# EAGLE design untitled (EAGLE 9.2.2)
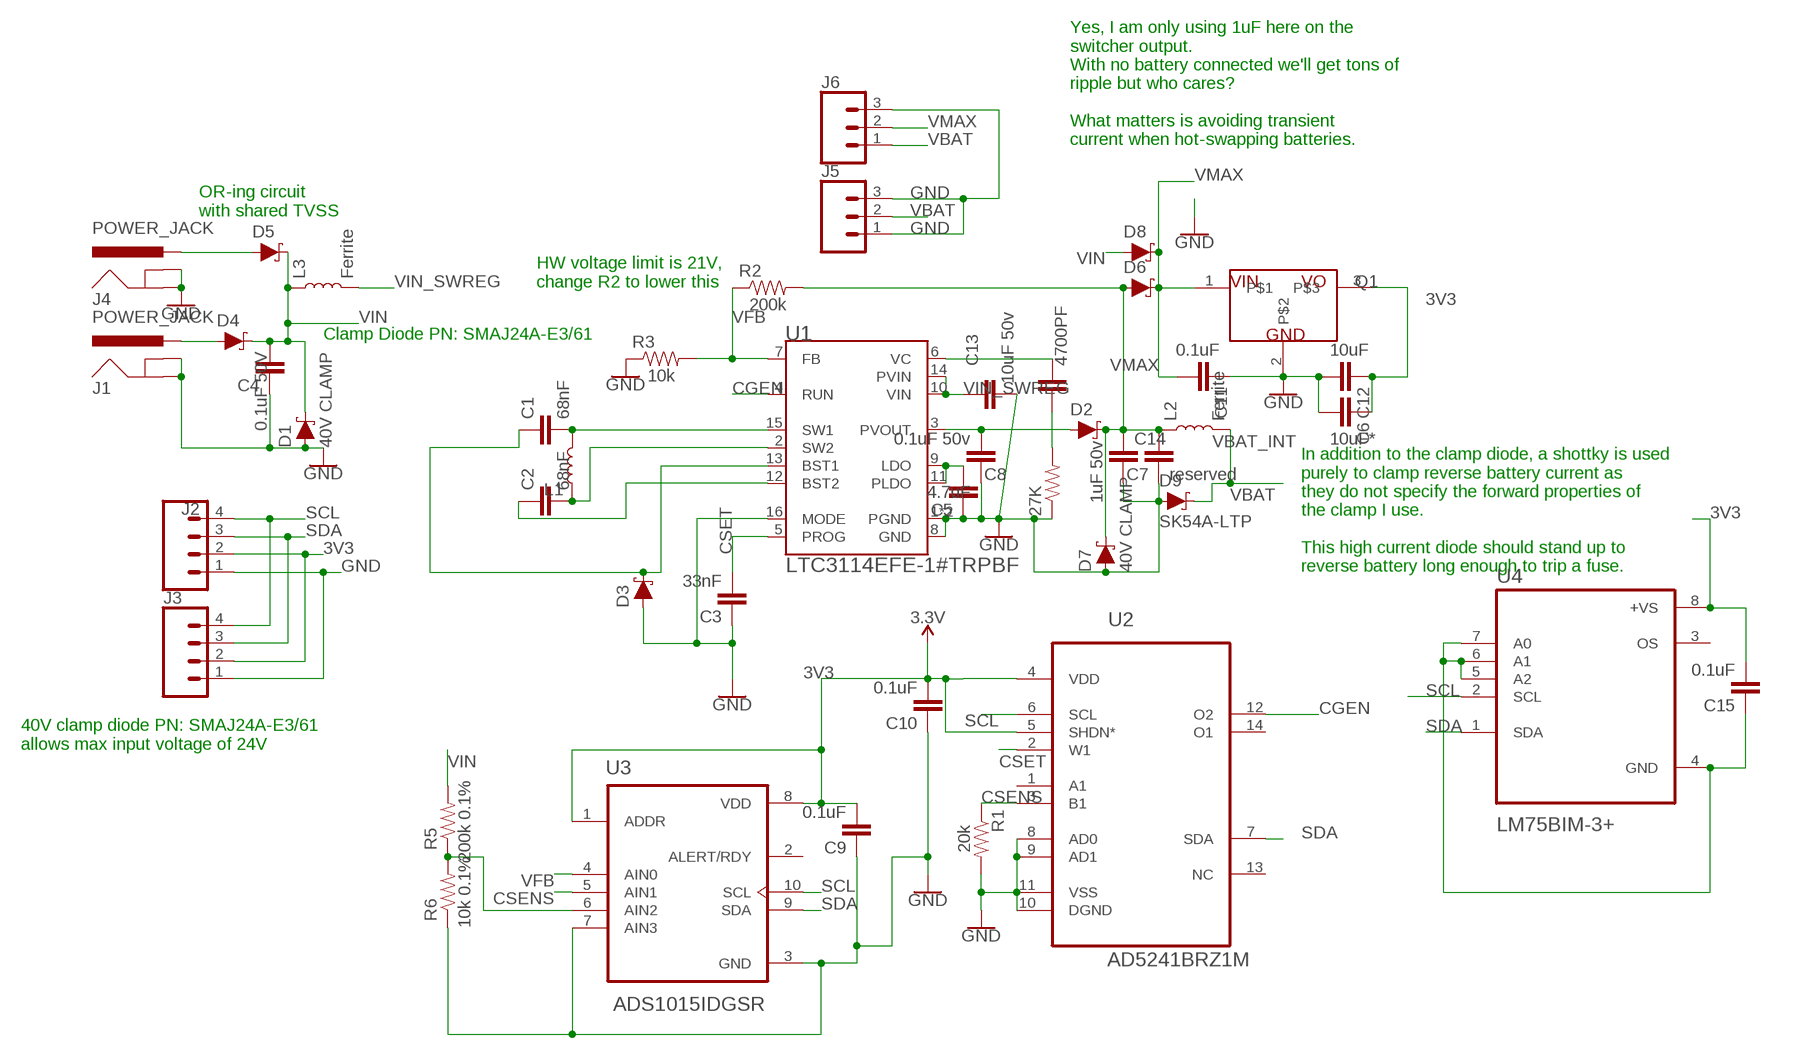
[diagram p0: schematic, sheet 1]

## Parts
27K  RESISTOR0805  [0805-EZ]
4700PF  1.0uF  1.0UF-0805-25V-10%  [0805-EZ]
C1  68nF  1.0UF-0805-25V-10%  [0805-EZ]
C2  68nF  1.0UF-0805-25V-10%  [0805-EZ]
C3  33nF  1.0UF-0805-25V-10%  [0805-EZ]
C4  0.1uF 50V  1.0UF-0805-25V-10%  [0805-EZ]
C5  4.7uF  1.0UF-0805-25V-10%  [0805-EZ]
C6  10uF*  1.0UF-0805-25V-10%  [0805-EZ]
C7  reserved  1.0UF-1206-50V-10%  [1206]
C8  0.1uF 50v  1.0UF-0805-25V-10%  [0805-EZ]
C9  0.1uF  1.0UF-0805-25V-10%  [0805-EZ]
C10  0.1uF  1.0UF-0805-25V-10%  [0805-EZ]
C11  0.1uF  1.0UF-0805-25V-10%  [0805-EZ]
C12  10uF  1.0UF-0805-25V-10%  [0805-EZ]
C13  10uF 50v  1.0UF-1206-50V-10%  [1206]
C14  1uF 50v  1.0UF-0805-25V-10%  [0805-EZ]
C15  0.1uF  1.0UF-0805-25V-10%  [0805-EZ]
D1  40V CLAMP  DIODE-SCHOTTKY-B340A  [SMA-DIODE]
D2  3A/40V/500mV  DIODE-SCHOTTKY-B340A  [SMA-DIODE]
D3  3A/40V/500mV  DIODE-SCHOTTKY-B340A  [SMA-DIODE]
D4  3A/40V/500mV  DIODE-SCHOTTKY-B340A  [SMA-DIODE]
D5  3A/40V/500mV  DIODE-SCHOTTKY-B340A  [SMA-DIODE]
D6  3A/40V/500mV  DIODE-SCHOTTKY-B340A  [SMA-DIODE]
D7  40V CLAMP  DIODE-SCHOTTKY-B340A  [SMA-DIODE]
D8  3A/40V/500mV  DIODE-SCHOTTKY-B340A  [SMA-DIODE]
D9  SK54A-LTP  DIODE-SCHOTTKY-B340A  [SMA-DIODE]
J1  POWER_JACK  [POWER_JACK_PTH]
J2  CONN_04JST-PTH-VERT  [JST-4-PTH-VERT]
J3  CONN_04JST-PTH-VERT  [JST-4-PTH-VERT]
J4  POWER_JACK  [POWER_JACK_PTH]
J5  CONN_03SCREW_LOCK  [SCREWTERMINAL-3.5MM-3_LOCK.007S]
J6  CONN_03SCREW_LOCK  [SCREWTERMINAL-3.5MM-3_LOCK.007S]
L1  27µH/±20%/3.3A  INDUCTOR-SDR13-27UH  [INDUCTOR_SDR1307]
L2  Ferrite  INDUCTOR-0805-3.3UH  [0805]
L3  Ferrite  INDUCTOR-0805-3.3UH  [0805]
Q1  BD433M5FP-CE2TO252_STM  [TO252_STM]
R1  20k  RESISTOR0805  [0805-EZ]
R2  200k  RESISTOR0805  [0805-EZ]
R3  10k  RESISTOR0805  [0805-EZ]
R5  200k 0.1%  RESISTOR0805  [0805-EZ]
R6  10k 0.1%  RESISTOR0805  [0805-EZ]
U1  LTC3114EFE-1#TRPBF  [SOP65P640X110-17N]
U2  AD5241BRZ1M  [SOIC127P600X175-14N]
U3  ADS1015IDGSR  [SOP50P490X110-10N]
U4  LM75BIM-3+  [SOIC127P600X175-8N]

## Nets
3V3: C6.1 C9.2 C10.2 C12.1 C15.2 J2.2 J3.2 Q1.3 U2.4(VDD) U2.5(SHDN*) U3.1(ADDR) U3.8(VDD) U4.8(+VS) ; supply symbol labelled 3.3V
CGEN: U1.4(RUN) U2.12(O2)
CSENS: R1.1 U2.3(B1) U3.5(AIN1)
CSET: C3.2 U1.5(PROG) U2.2(W1)
GND: 27K.1 C3.1 C4.1 C5.1 C6.2 C7.1 C8.1 C9.1 C10.1 C11.1 C12.2 C13.2 C14.2 D1.A D3.A D7.A D9.A J1.GND J1.GNDBREAK J2.1 J3.1 J4.GND J4.GNDBREAK J5.1 J5.3 J6.3 Q1.2 R1.2 R3.1 R6.1 U1.1(PGND) U1.8(GND) U1.16(MODE) U1.17(PGND) U2.8(AD0) U2.9(AD1) U2.10(DGND) U2.11(VSS) U3.3(GND) U3.7(AIN3)
N$1: C1.2 L1.P$2 U1.15(SW1)
N$2: C2.2 L1.P$1 U1.2(SW2)
N$3: C1.1 D3.C U1.13(BST1)
N$4: C2.1 U1.12(BST2)
N$5: D4.A J1.PWR
N$6: R5.1 R6.2 U3.6(AIN2)
N$7: C15.1 U4.4(GND) U4.5(A2) U4.6(A1) U4.7(A0)
N$8: D5.A J4.PWR
N$9: C8.2 D2.A U1.3(PVOUT)
N$13: C5.2 U1.9(LDO) U1.11(PLDO)
N$14: 4700PF.2 U1.6(VC)
N$15: 27K.2 4700PF.1
SCL: J2.4 J3.4 U2.6(SCL) U3.10(SCL) U4.2(SCL)
SDA: J2.3 J3.3 U2.7(SDA) U3.9(SDA) U4.1(SDA)
VBAT: D9.C J5.2 J6.1 L2.2
VBAT_INT: C7.2 C14.1 D2.C D6.A D7.C L2.1 R2.2
VFB: R2.1 R3.2 U1.7(FB) U3.4(AIN0)
VIN: C4.2 D1.C D4.C D5.C D8.A L3.1 R5.2
VIN_SWREG: C13.1 L3.2 U1.10(VIN) U1.14(PVIN)
VMAX: C11.2 D6.C D8.C J6.2 Q1.1
Unconnected: U2.1(A1) U2.13(NC) U2.14(O1) U3.2(ALERT/RDY) U4.3(OS)

## Notes on the sheet
- Yes, I am only using 1uF here on the 
  switcher output. 
  With no battery connected we'll get tons of
  ripple but who cares?
  
  What matters is avoiding transient
  current when hot-swapping batteries.
- OR-ing circuit
  with shared TVSS
- HW voltage limit is 21V,
  change R2 to lower this
- Clamp Diode PN: SMAJ24A-E3/61
- In addition to the clamp diode, a shottky is used
  purely to clamp reverse battery current as
  they do not specify the forward properties of
  the clamp I use.
  
  This high current diode should stand up to
  reverse battery long enough to trip a fuse.
- 40V clamp diode PN: SMAJ24A-E3/61
  allows max input voltage of 24V

## Library data of the parts
27K R1-R3 R5 R6 = smd_passives_easy:RESISTOR: Generic Resistor Package
4700PF = smd_passives_easy:1.0UF: 1µF ceramic capacitors A capacitor is a passive two-terminal electrical component used to store electrical energy temporarily in an electric field.; PROD_ID: CAP-08064
C1-C6 C8-C12 C14 C15 = smd_passives_easy:1.0UF: 1µF ceramic capacitors A capacitor is a passive two-terminal electrical component used to store electrical energy temporarily in an electric field.; PROD_ID: CAP-08064; VALUE: 1.0uF
C7 C13 = SparkFun-Capacitors:1.0UF: 1µF ceramic capacitors A capacitor is a passive two-terminal electrical component used to store electrical energy temporarily in an electric field.; PROD_ID: CAP-09822; VALUE: 1.0uF
D1 D7 D9 = SparkFun-DiscreteSemi:DIODE-SCHOTTKY: Schottky diode A Schottky diode is a semiconductor diode which has a low forward voltage drop and a very fast switching action.; PROD_ID: DIO-09886; VALUE: 3A/40V/500mV
D2-D6 D8 = SparkFun-DiscreteSemi:DIODE-SCHOTTKY: Schottky diode A Schottky diode is a semiconductor diode which has a low forward voltage drop and a very fast switching action.; PROD_ID: DIO-09886
J1 J4 = SparkFun-Connectors:POWER_JACK: Power Jack Connector This is the standard 5.5mm barrel jack for power. The PTH is the most common, proven, reliable, footprint. The Slot footprint only works if the mill layer is transmitted to the PCB fab house so be warned. Here are the connectors we sell at SparkFun: DC Barrel Power Jack/Connector <https://www.sparkfun.com/products/119> (PRT-00119) DC Barrel Power Jack/Connector (SMD) <https://www.sparkfun.com/products/12748> (PRT-12748) DC Barrel Jack Adapter - Breadboard Compatible <https://www.sparkfun.com/products/10811> (PRT-10811) It is used on this SparkFun product (and many, many others): SparkFun RedBoard - Programmed with Arduino <https://www.sparkfun.com/products/12757> (DEV-12757) Also, if you need a mating power supply or connector, please check these out: Wall Adapter Power Supply - 9VDC 650mA <https://www.sparkfun.com/products/298> (TOL-00298) DC Barrel Jack Adapter - Male <https://www.sparkfun.com/products/10287> (PRT-10287); PROD_ID: CONN-08197
J2 J3 = SparkFun-Connectors:CONN_04: Multi connection point. Often used as Generic Header-pin footprint for 0.1 inch spaced/style header connections On any of the 0.1 inch spaced packages, you can populate with these: Break Away Headers - Straight <https://www.sparkfun.com/products/116> (PRT-00116) Break Away Male Headers - Right Angle <https://www.sparkfun.com/products/553> (PRT-00553) Female Headers <https://www.sparkfun.com/products/115> (PRT-00115) Break Away Headers - Machine Pin <https://www.sparkfun.com/products/117> (PRT-00117) Break Away Female Headers - Swiss Machine Pin <https://www.sparkfun.com/products/743> (PRT-00743) For SCREWTERMINALS and SPRING TERMINALS visit here: Screw Terimnals on SparkFun.com <https://www.sparkfun.com/search/results?term=Screw+Terminals> (5mm/3.5mm/2.54mm spacing) This device is also useful as a general connection point to wire up your design to another part of your project. Our various solder wires solder well into these plated through hole pads. Hook-Up Wire - Assortment (Stranded, 22 AWG) <https://www.sparkfun.com/products/11375> (PRT-11375) Hook-Up Wire - Assortment (Solid Core, 22 AWG) <https://www.sparkfun.com/products/11367> (PRT-11367) View the entire wire category on our website here <https://www.sparkfun.com/categories/141> Special notes: Molex polarized connector foot print use with SKU : PRT-08231 with associated crimp pins and housings. 1MM SMD Version SKU: PRT-10208; PROD_ID: CONN-13251
J5 J6 = SparkFun-Connectors:CONN_03: Multi connection point. Often used as Generic Header-pin footprint for 0.1 inch spaced/style header connections On any of the 0.1 inch spaced packages, you can populate with these: Break Away Headers - Straight <https://www.sparkfun.com/products/116> (PRT-00116) Break Away Male Headers - Right Angle <https://www.sparkfun.com/products/553> (PRT-00553) Female Headers <https://www.sparkfun.com/products/115> (PRT-00115) Break Away Headers - Machine Pin <https://www.sparkfun.com/products/117> (PRT-00117) Break Away Female Headers - Swiss Machine Pin <https://www.sparkfun.com/products/743> (PRT-00743) Stackable Header - 3 Pin (Female, 0.1") <https://www.sparkfun.com/products/13875> (PRT-13875) For SCREWTERMINALS and SPRING TERMINALS visit here: Screw Terimnals on SparkFun.com <https://www.sparkfun.com/search/results?term=Screw+Terminals> (5mm/3.5mm/2.54mm spacing) This device is also useful as a general connection point to wire up your design to another part of your project. Our various solder wires solder well into these plated through hole pads. Hook-Up Wire - Assortment (Stranded, 22 AWG) <https://www.sparkfun.com/products/11375> (PRT-11375) Hook-Up Wire - Assortment (Solid Core, 22 AWG) <https://www.sparkfun.com/products/11367> (PRT-11367) View the entire wire category on our website here <https://www.sparkfun.com/categories/141> Special notes: Molex polarized connector foot print use with SKU : PRT-08232 with associated crimp pins and housings.; PROD_ID: CONN-08288; SF_ID: PRT-08235
L1 = SparkFun-Coils:INDUCTOR: Inductors Resist changes in electrical current. Basically a coil of wire. SparkFun Products: SparkFun Load Cell Amplifier - HX711 <https://www.sparkfun.com/products/13879> IOIO-OTG - V2.2 <https://www.sparkfun.com/products/13613>; PROD_ID: NDUC-12529
L2 L3 = SparkFun-Coils:INDUCTOR: Inductors Resist changes in electrical current. Basically a coil of wire. SparkFun Products: SparkFun Load Cell Amplifier - HX711 <https://www.sparkfun.com/products/13879> IOIO-OTG - V2.2 <https://www.sparkfun.com/products/13613>; PROD_ID: NDUC-13076; VALUE: 3.3µH/±20%/450mA
Q1 = danny:BD433M5FP-CE2: IGBT
U1 = LTC3114EFE-1_TRPBF:LTC3114EFE-1#TRPBF: LTC3114-1 - 40V, 1A Synchronous Buck-Boost DC/DC Converter with Programmable Output Current; AVAILABILITY: Unavailable; DESCRIPTION: LTC3114-1 - 40V, 1A Synchronous Buck-Boost DC/DC Converter with Programmable Output Current; MF: Linear Technology/Analog; MP: LTC3114EFE-1#TRPBF; PACKAGE: TSSOP-16 Linear Technology; PRICE: None
U2 = AD5241BRZ1M:AD5241BRZ1M: I2C Compatible Digital Potentiometer; AVAILABILITY: Unavailable; DESCRIPTION: Digital Potentiometer 256POS 1MkOhm Single 14-Pin SOIC N Tube; MF: Analog Devices; MP: AD5241BRZ1M; PACKAGE: SOIC-14 Analog Devices; PRICE: None
U3 = ADS1015IDGSR:ADS1015IDGSR: 12-Bit ADC with Integrated MUX, PGA, Comparator, Oscillator, and Reference 10-VSSOP -40 to 125; AVAILABILITY: Unavailable; DESCRIPTION: 12-Bit ADC with Integrated MUX, PGA, Comparator, Oscillator, and Reference 10-VSSOP -40 to 125; MF: Texas Instruments; MP: ADS1015IDGSR; PACKAGE: MSOP-10 Texas Instruments; PRICE: None
U4 = LM75BIM-3_:LM75BIM-3+; AVAILABILITY: Unavailable; DESCRIPTION: Temp Sensor Digital Serial _2-Wire, I2C_ 8-Pin SOIC Tube; MF: Maxim Integrated; MP: LM75BIM-3+; PACKAGE: SOIC-8 Maxim; PRICE: None

## Board
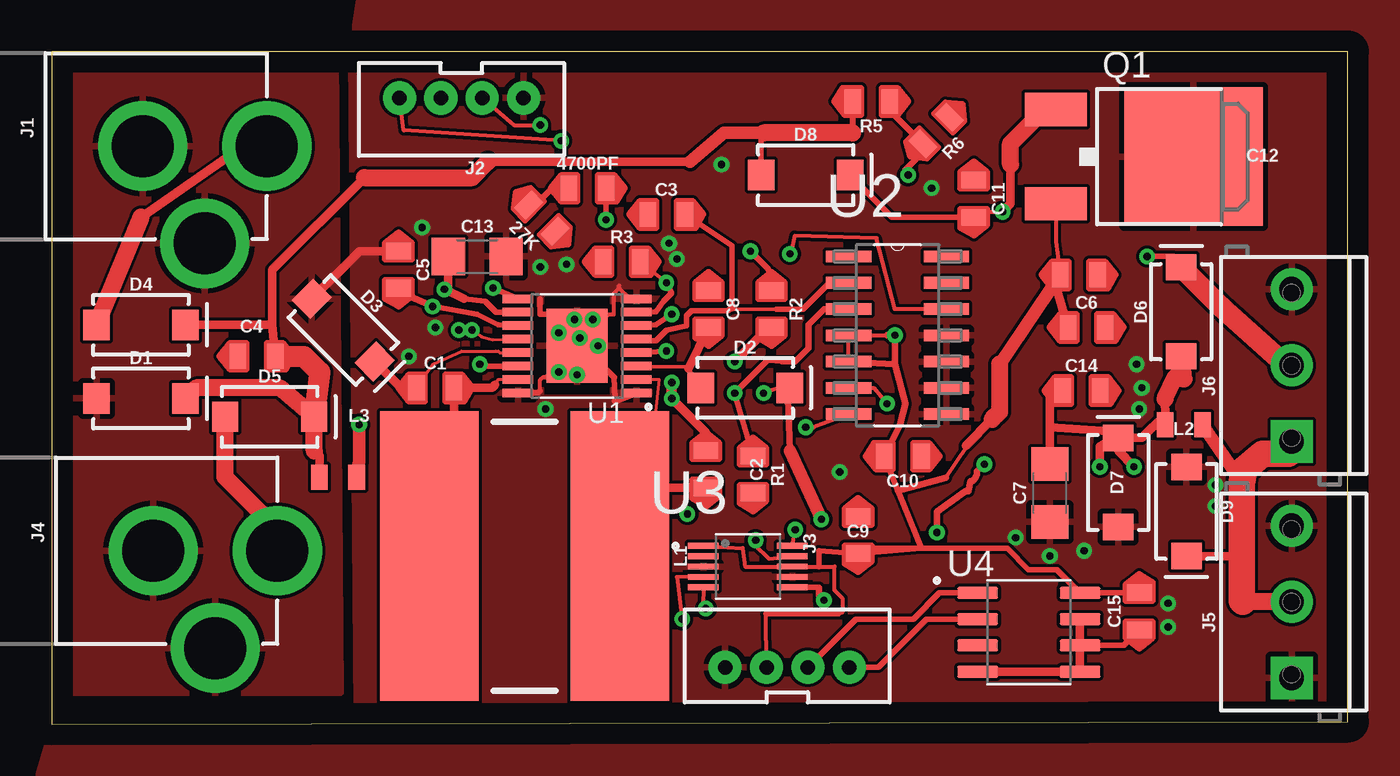
[diagram p1: board, top side]
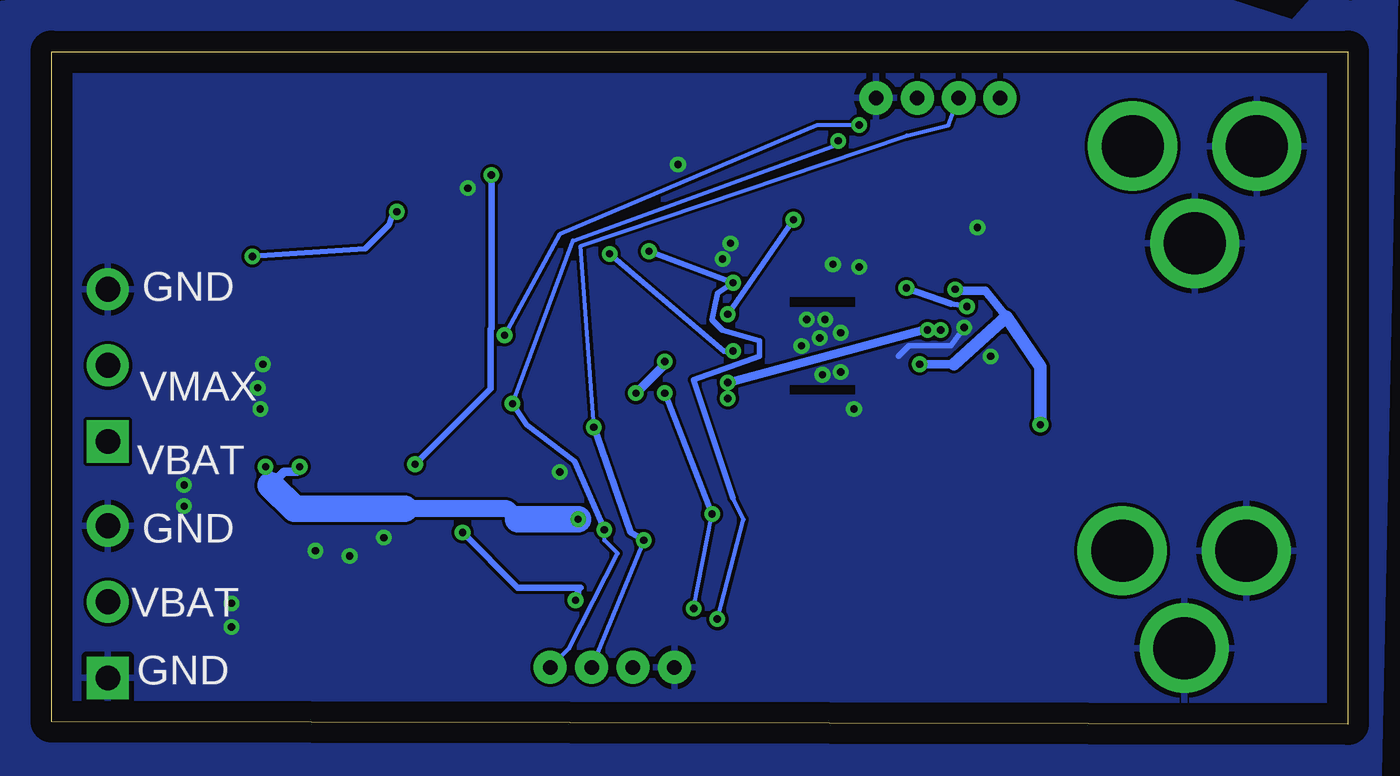
[diagram p2: board, bottom side, seen from below]

Size 62.66 x 32.5 mm. Coordinates in mm from the lower left corner, seen from the top.
Outline: 0,0 62.66,0.13 62.66,32.5 0,32.5 0,0
Copper layers (1*16): Top 0.035mm / dielectric 1.5mm / Bottom 0.035mm
Design rules "default": minimum track width 6mil, minimum drill 0.35mm, track to track 6mil, track to pad 6mil, pad to pad 6mil, via to via 6mil, smd to smd 6mil, copper to edge 40mil, drill to drill 6mil, minimum pad ring 10mil, minimum via ring 8mil, stop-mask expansion 4mil, vias tented up to drill 0mil, thermal gap 10mil

### Footprints (pad centres in the part's own frame; a part is rotated, then mirrored left to right if it is on the bottom)
0805-EZ = smd 0.8 x 1.2: 1 -0.9,0; 2 0.9,0
1206 = smd 1.6 x 1.8: 1 -1.4,0; 2 1.4,0
SMA-DIODE = smd 1.27 x 1.47: A -2.15,0; C 2.15,0
POWER_JACK_PTH = drill 2.997 pad 4.318: GND 0,7.7; GNDBREAK 4.7,10.7; PWR 0,13.7
JST-4-PTH-VERT = drill 0.7 pad 1.6: 1 -3,-0.55; 2 -1,-0.55; 3 1,-0.55; 4 3,-0.55
SCREWTERMINAL-3.5MM-3_LOCK.007S = drill 1.2 pad 2.032 square: 1 -0.178,0 | drill 1.2 pad 2.032: 2 3.5,0; 3 7.178,0
INDUCTOR_SDR1307 = smd 14 x 4.75: P$1 0,4.6; P$2 0,-4.6
0805 = smd 0.8 x 1.2: 1 -0.9,0; 2 0.9,0
TO252_STM = smd 1.6 x 3: 1 -2.28,-4.153; 3 2.28,-4.153 | smd 6.7 x 6.7: 2 0,2.5
SOP65P640X110-17N = smd 1.48 x 0.41: 1 -2.865,2.275; 2 -2.865,1.625; 3 -2.865,0.975; 4 -2.865,0.325; 5 -2.865,-0.325; 6 -2.865,-0.975; 7 -2.865,-1.625; 8 -2.865,-2.275; 9 2.865,-2.275; 10 2.865,-1.625; 11 2.865,-0.975; 12 2.865,-0.325; 13 2.865,0.325; 14 2.865,0.975; 15 2.865,1.625; 16 2.865,2.275 | smd 2.94 x 3.58: 17 0,0
SOIC127P600X175-14N = smd 2.184 x 0.559: 1 -2.362,3.81; 2 -2.362,2.54; 3 -2.362,1.27; 4 -2.362,0; 5 -2.362,-1.27; 6 -2.362,-2.54; 7 -2.362,-3.81; 8 2.362,-3.81; 9 2.362,-2.54; 10 2.362,-1.27; 11 2.362,0; 12 2.362,1.27; 13 2.362,2.54; 14 2.362,3.81
SOP50P490X110-10N = smd 1.47 x 0.28: 1 -2.15,1; 2 -2.15,0.5; 3 -2.15,0; 4 -2.15,-0.5; 5 -2.15,-1; 6 2.15,-1; 7 2.15,-0.5; 8 2.15,0; 9 2.15,0.5; 10 2.15,1
SOIC127P600X175-8N = smd 1.97 x 0.59: 1 -2.475,1.905; 2 -2.475,0.635; 3 -2.475,-0.635; 4 -2.475,-1.905; 5 2.475,-1.905; 6 2.475,-0.635; 7 2.475,0.635; 8 2.475,1.905

### Placement (x,y rotation side)
27K  23.7,24.46 135 top
4700PF  25.91,25.91 0 top
C1  18.54,16.26 0 top
C2  31.62,12.32 270 top
C3  29.72,24.64 0 top
C4  9.91,17.78 0 top
C5  16.76,21.97 270 top
C6  50.04,19.18 0 top
C7  48.26,11.18 90 top
C8  31.75,20.07 270 top
C9  38.99,9.14 270 top
C10  41.15,12.95 180 top
C11  44.58,25.4 270 top
C12  49.66,21.72 0 top
C13  20.57,22.61 0 top
C14  49.78,16.13 0 top
C15  52.58,5.46 90 top
D1  4.32,15.75 0 top
D2  33.53,16.26 0 top
D3  14.1,19.05 315 top
D4  4.32,19.3 0 top
D5  10.54,14.86 0 top
D6  54.61,19.94 90 top
D7  51.56,11.68 90 top
D8  36.45,26.54 0 top
D9  54.86,10.29 270 top
J1  -3.3,27.94 270 top
J2  19.81,29.72 180 top
J3  35.56,3.3 0 top
J4  -2.79,8.38 270 top
J5  59.94,2.41 90 top
J6  59.94,13.84 90 top
L1  22.86,8.13 270 top
L2  54.74,14.48 0 top
L3  13.84,11.94 0 top
Q1  52.7,27.43 270 top
R1  33.91,12.07 270 top
R2  34.8,20.07 270 top
R3  27.56,22.35 0 top
R5  39.62,30.1 180 top
R6  42.76,28.7 225 top
U1  25.4,18.29 180 top
U2  40.89,18.8 0 top
U3  33.66,7.62 0 top
U4  47.24,4.45 0 top

### Tracks (layer width: path | path; a pad name or v marks a point on that pad's centre or on a via)
3V3  (via drill 0.35)
  Top 0.203: J3.2 34.54,5.33 | J2.2 22.35,28.96 v23.62,28.96 | 40.49,18.8 40.39,18.8 U2.4 U2.5 | 38.04,5.33 38.23,5.41 38.23,6.1 37.85,6.48 37.85,7.62 37.08,7.62 U3.8 33.53,7.62 33.4,8.51 U3.1 | Q1.3 48.55,23.32 C12.1 | 43.23,11.92 44.25,13.41 44.2,13.46
  Top 0.254: C10.2 40.7,11.82 40.92,11.29 41.2,10.59 42.04,8.51 C9.2 | 34.54,5.33 38.04,5.33 | 37.08,7.62 37.08,8.38 C9.2 | C9.2 39.24,8.5 46.2,8.5 47.23,7.47 48.6,7.47 U4.8 C15.2
  Top 0.305: 40.92,11.29 43.23,11.92 | 40.39,18.8 v40.77,18.8 40.77,17.4 | 40.77,17.4 U2.5 | 40.77,17.4 41.27,15.49 41.02,14.48 C10.2
  Top 0.406: C6.1 48.5,21.34 C12.1 | 44.2,13.46 45.47,14.73
  Top 0.61: 45.84,17.4 C12.1
  Top 0.813: 45.47,14.73 45.84,15.1 45.84,17.4
  Bottom 0.203: v23.62,28.96 25.65,28.96 38.1,23.67 v40.77,18.8
CGEN  (via drill 0.35)
  Top 0.203: U2.12 40.77,20.07 39.88,23.49 35.91,23.6 35.75,22.8 v35.69,22.73
  Top 0.254: U1.4 v29.72,18.03
  Bottom 0.254: v35.69,22.73 30.16,18.03 v29.72,18.03
CSENS  (via drill 0.35)
  Top 0.203: U3.5 31.5,5.72 v31.62,5.59
  Top 0.254: 35.56,17.53 35.3,17.54 34.6,17.58 v33.02,16 R1.1
  Top 0.305: 35.3,17.54 35.95,17.54 36.58,18.16 36.58,19.3 37.34,20.07 U2.3
  Bottom 0.203: v31.62,5.59 v30.73,10.16
  Bottom 0.254: v30.73,10.16 v33.02,16
CSET
  Top 0.203: 32.9,20.09 35.05,20.07
  Top 0.254: U1.5 28.7,18.54 29.21,18.54 29.72,19.05 30.68,19.25 30.68,19.74 30.94,19.99 32.69,19.99 32.77,20.07 32.9,20.09 32.89,23.11 C3.2 | 35.05,20.07 36.32,20.07 37.59,21.34 U2.2
GND  (via drill 0.35)
  Top 0.203: 27.43,21.08 27.18,20.83 27.18,19.81 26.92,19.81 U1.17 23.88,16.76 23.75,16.76 23.62,16.64 23.62,16.13 | 27.43,21.08 27.43,21.21 | U1.8 27.95,20.56 27.43,21.08
  Top 0.254: 24.38,19.81 23.62,19.81 23.62,20.57 | 27.18,16.76 27.22,15.75 27.23,15.61 | U1.16 23.51,16.01 23.62,16.13
  Top 0.305: U1.1 27.23,15.61 | 27.18,16.76 26.42,17.53
  Top 0.406: 26.42,17.53 v26.42,18.29 | D3.A 14.88,22.87 C5.1
  Bottom 0.254: v18.54,19.18 19.18,18.29 21.21,18.29 21.72,17.78
  other vias: 26.16,19.56 23.88,15.24 17.91,24 29.84,23.24 30.23,22.48 23.62,22.1 25.27,19.56 25.53,18.67 24.51,17.02 24.51,18.92 38.1,12.19 32.38,27.05 42.55,25.91 17.27,17.78 49.91,8.38 48.26,8.13 52.45,17.4 52.7,16.26 46.61,9.02 52.58,15.24 56.26,10.54 53.98,5.84 53.98,4.7 24.89,22.23 25.4,16.89 56.26,11.56
  pour Top: 14.48,32.51 14.73,0.51 0.25,0.51 -3.3,-11.43 -3.05,-14.99 78.58,-17.77 93.73,-11.71 94.11,33.65 26.67,38.52 15.49,39.12
  pour Top: 0,32.51 13.72,32.51 13.97,1.52 0,1.52
  pour Bottom: -2.29,35.31 -1.27,-12.7 61.34,-13.59 90.68,31.75 57.02,35.81 15.49,38.1 2.67,33.91 0.76,36.07 0,34.8
N$1
  Top 0.152: C1.2 19.56,16.26 20.57,16.26 | 21.44,16.41 21.59,16.66 U1.15 | 18.26,13.33 L1.P$2
  Top 0.406: 21.44,16.41 21.28,16.26 19.56,16.26 | C1.2 19.44,14.36 18.41,13.33 18.26,13.33
N$2
  Top 0.152: L1.P$1 27.46,12.73 28.83,11.81 | 29.21,11.3 28.83,11.81 | U1.2 29.36,16.66 28.83,11.81
  Top 0.406: L1.P$1 29.21,9.88 29.21,11.3 29.33,11.42 C2.2
N$3
  Top 0.152: C1.1 18.4,17.39 19.81,18.03 21.46,18.03 21.59,18.03 21.66,17.96 U1.13
  Top 0.406: C1.1 16.89,16.26 D3.C
N$4  (via drill 0.35)
  Top 0.152: v20.32,19.05 20.78,18.72 21.34,18.59 U1.12
  Top 0.406: C2.1 31.62,14.1 v29.97,15.75 | v19.68,19.05 v20.32,19.05
  Top 0.508: v29.97,15.75 v29.97,16.51
  Bottom 0.152: 20.57,19.04 v19.68,19.05
  Bottom 0.406: v29.97,16.51 20.57,19.04
N$5
  Top 0.406: 4.32,24.51 9.65,28.19 J1.PWR
  Top 0.813: D4.A 4.32,24.51
N$6  (via drill 0.35)
  Top 0.254: 37.08,6.6 37.07,6.62 U3.6
  Top 0.305: R5.1 40.52,29.66 R6.2 42.12,27.65 41.27,26.8 v41.4,26.54 | v42.8,9.27 42.8,10.28 44.17,11.26 44.32,11.26 44.43,11.75 44.55,11.78 44.59,11.84 44.65,11.87 44.68,12 44.74,12.06 44.74,12.22 v45.09,12.57 | v37.34,5.99 37.08,6.25 37.08,6.6
  Bottom 0.305: v41.4,26.54 41.4,19.13 41.45,19.08 41.45,16.21 v45.09,12.57 | v42.8,9.27 40.13,6.6 37.21,6.6 | 37.21,6.6 37.08,6.6 | 37.21,6.6 37.21,6.12 v37.34,5.99
N$7
  Top 0.254: C15.1 51.83,3.81 U4.6
  Top 0.406: U4.4 U4.5 U4.6 U4.7
N$8
  Top 0.813: J4.PWR 10.91,9.41 8.38,11.94 8.38,14.85 D5.A
N$9
  Top 0.203: U1.3 30.73,17.27 30.79,17.18 D2.A
  Top 0.406: 30.79,17.18 C8.2
N$13  (via drill 0.35)
  Top 0.254: U1.9 v21.34,21.08 | v18.41,20.19 20.57,19.81 21.59,19.3 U1.11
  Top 0.305: v18.41,20.19 16.63,20.96 C5.2
  Bottom 0.254: 19.18,20.32 v18.41,20.19
  Bottom 0.305: v21.34,21.08 19.18,20.32
N$14  (via drill 0.35)
  Top 0.254: U1.6 29.21,19.3 v29.97,19.81 | v26.8,24.38 4700PF.2
  Bottom 0.254: v29.97,19.81 v26.8,24.38
N$15
  Top 0.254: 23.6,25.32 24.19,25.91 4700PF.1
  Top 0.305: 27K.2 23.6,25.32
SCL  (via drill 0.35)
  Top 0.203: v24.64,28.19 17.02,28.7 J2.4 | U2.6 39.75,16.26 v40.39,15.49 | U3.10 v35.94,9.4
  Top 0.254: U4.2 42.29,5.08 39.96,2.75 J3.4
  Bottom 0.203: J3.4 37.64,3.67 35.31,8.26 35.94,8.89 v35.94,9.4 | v40.39,15.49 37.47,23.37 24.89,27.94 v24.64,28.19
  Bottom 0.254: v35.94,9.4 37.38,12.7 39.7,14.48 v40.39,15.49
SDA  (via drill 0.35)
  Top 0.203: U2.7 36.83,14.35 v36.45,14.35 | U3.9 34.67,8 34.04,8.64 v34.04,8.89
  Top 0.254: J3.3 38.89,5.08 41.66,5.08 42.93,6.35 U4.1
  Bottom 0.203: v36.45,14.35 37.08,23.11 21.34,28.45 19.3,28.96 J2.3 | v34.04,8.89 J3.3
  Bottom 0.305: v34.04,8.89 34.67,9.27 v36.45,14.35
VBAT
  Top 0.406: D9.C 54.87,8.13 57.53,8.13
  Top 0.61: L2.2 57.53,11.68
  Top 0.813: J6.1 59.78,13.5 59.78,13.08 | J5.2 57.59,5.91
  Top 1.27: 57.59,5.91 57.53,5.97 57.53,8.13 57.53,11.68 57.66,12.32 58.55,13.08 59.78,13.08
VBAT_INT  (via drill 0.35)
  Top 0.203: D2.C 35.58,16.37 35.18,16.26 v34.42,16 | R2.2 34.71,19.22
  Top 0.254: C14.1 48.88,16.12 48.25,16.12
  Top 0.305: 35.69,13.21 35.58,16.37
  Top 0.406: v33.02,17.53 34.71,19.22 | C7.2 48.25,14.35 | 48.25,14.35 51.86,14.11 | 51.86,14.11 D7.C | v52.32,12.45 51.56,13.21 D7.C | v50.67,12.45 50.67,13.43 51.86,14.11 | 48.25,16.12 48.25,14.35 | D7.C 52.7,13.83 53.24,14.38 53.26,14.38 53.46,14.58 53.85,14.83 | 53.85,14.83 53.82,15.72 | L2.1 53.84,14.57 53.85,14.83
  Top 0.61: v37.21,9.91 35.69,13.21
  Top 0.813: 53.82,15.72 54.33,16.79 54.74,16.69 D6.A
  Bottom 0.406: v52.32,12.45 52.2,12.45 52.2,11.68 52.07,11.56 51.44,12.19 50.8,12.19 50.67,12.32 v50.67,12.45 | v33.02,17.53 33.02,17.4 v34.42,16
  Bottom 0.813: 40.12,9.91 40.63,10.41 45.59,10.41
  Bottom 1.27: v37.21,9.91 40.12,9.91 | 45.59,10.41 50.93,10.41 52.07,11.56
VFB  (via drill 0.35)
  Top 0.203: U3.4 30.23,7.11 v30.48,5.08 | v29.72,21.34 29.08,21.84 28.32,21.96 R3.2
  Top 0.254: v29.72,21.34 29.97,20.83 29.59,20.45 29.21,19.94 U1.7 | R2.1 34.66,21.98 v33.78,22.86
  Bottom 0.203: v30.48,5.08 29.21,9.91 29.72,10.92
  Bottom 0.254: v33.78,22.86 v29.72,21.34 30.48,20.83 30.73,19.56 30.23,19.05 28.45,18.54 28.45,17.78 31.62,16.64 29.72,10.92
VIN
  Top 0.254: 38.61,30.1 38.73,29.98 38.73,28.57 38.73,28.45 38.72,28.45 R5.2 | D8.A 34.3,28.46 34.42,28.57
  Top 0.305: 38.61,30.1 R5.2
  Top 0.406: C4.2 10.67,19.3 | 10.67,19.3 D4.C | 10.67,19.3 10.67,21.97 15.12,26.42 | 21.08,27.18 30.86,27.18 | L3.1 12.94,12.97 12.7,13.21
  Top 0.61: 34.42,28.57 32.51,28.57 30.86,27.18
  Top 0.813: 38.73,28.57 34.42,28.57 | D1.C 6.99,16.26 11.04,16.26 D5.C 12.69,13.22 12.7,13.21 | 15.12,26.42 20.33,26.42 21.08,27.18
  Top 1.016: C4.2 12.19,17.78 12.95,17.02 D5.C
VIN_SWREG  (via drill 0.35)
  Top 0.254: 19.94,20.57 20.95,20.45 21.49,19.91 U1.10 | U1.14 20.79,17.31 v20.7,17.4
  Top 0.406: C13.1 19.17,21.09 v18.99,21.02 19.94,20.57
  Top 0.61: v14.86,14.48 14.86,12.71 L3.2
  Bottom 0.254: 18.67,20.96 v18.99,21.02
  Bottom 0.406: v20.7,17.4 19.05,17.4 | 16.51,19.69 17.53,20.96 18.67,20.96
  Bottom 0.61: 19.05,17.4 16.51,19.69 14.86,17.27 v14.86,14.48
VMAX  (via drill 0.35)
  Top 0.203: C11.2 44.65,24.57 44.84,24.77 v45.97,24.77 46.16,24.83 | 47.49,29.71 48.01,29.71 Q1.1
  Top 0.254: D8.C 40.63,24.51 C11.2 44.65,24.57 | 46.16,24.83 46.23,24.89 | D6.C 54.35,22.48 54.23,22.61 v52.96,22.61
  Top 0.406: v45.97,24.77 46.35,25.15 46.35,27.05
  Top 0.813: J6.2 59.85,17.44 59.57,17.44 | 46.35,27.05 46.35,28.06 48.01,29.71
  Top 1.016: D6.C 56.52,20.18 59.57,17.44
  Bottom 0.254: v52.96,22.61 47.5,22.99 46.35,24.13 46.23,24.51 v45.97,24.77

### Text on the board
_bsilk: GND | VMAX | VBAT | GND | VBAT | GND